# Altium schematic sheet BFMC_PowerDistribution.SchDoc
size A; SheetNumber: 4; SheetTotal: 7
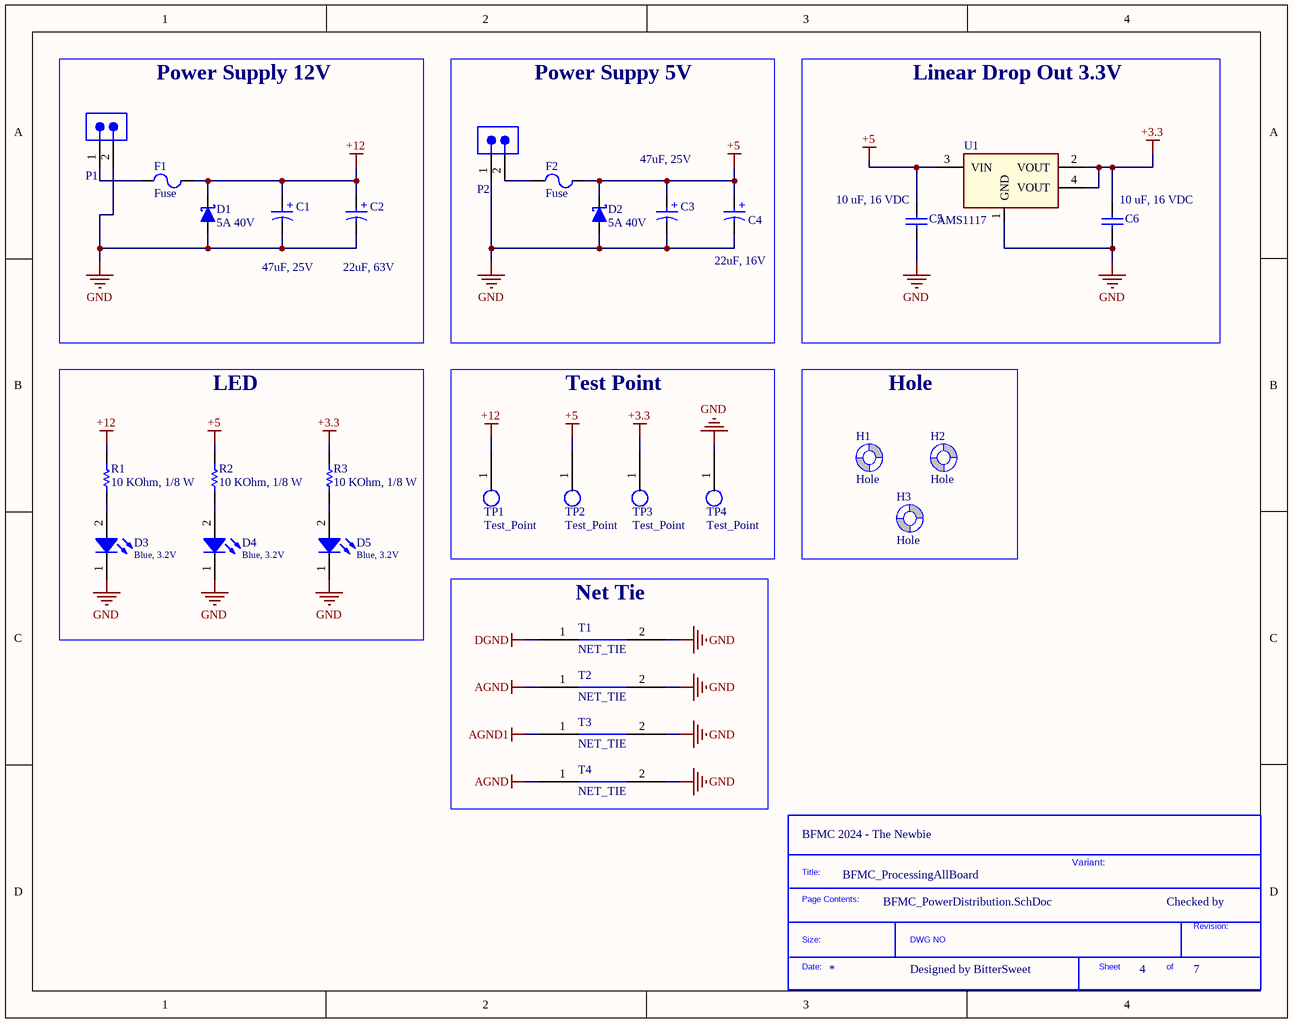
[diagram p0: BFMC_PowerDistribution.SchDoc]

## Parts
*?  SDTitleBlock  (value not drawn)  (graphical)
C1  47uF, 25V  [WCAP-ASLI_D6.3H5.5]
C2  22uF, 63V  [WCAP-ASLI_D6.3H7.7]
C3  47uF, 25V  [WCAP-ASLI_D6.3H5.5]
C4  22uF, 16V  [WCAP-ASLI_D4H5.5]
C5  10 uF, 16 VDC  [CAP_0805]
C6  10 uF, 16 VDC  [CAP_0805]
D1  5A 40V  [DO-214AB, SMA]
D2  5A 40V  [DO-214AB, SMA]
D3  Blue, 3.2V  [WL-SMCW_0805]
D4  Blue, 3.2V  [WL-SMCW_0805]
D5  Blue, 3.2V  [WL-SMCW_0805]
F1  Fuse  [FuseHolder1808]
F2  Fuse  [FuseHolder1808]
H1  Hole  [Hole_3.2mm]
H2  Hole  [Hole_3.2mm]
H3  Hole  [HOLE_RECTANGLE]
P1  10A, 300V  [691322310002]  (value not drawn)
P2  10A, 300V  [691322310002]  (value not drawn)
R1  10 KOhm, 1/8 W  [RESISTOR_0805]
R2  10 KOhm, 1/8 W  [RESISTOR_0805]
R3  10 KOhm, 1/8 W  [RESISTOR_0805]
T1  NET_TIE  [NET_TIE_2.0mm]
T2  NET_TIE  [NET_TIE_0.5MM]
T3  NET_TIE  [NET_TIE_0.5MM]
T4  NET_TIE  [NET_TIE_0.5MM]
TP1  Test_Point  [TP_1_5mm_SMD]
TP2  Test_Point  [TP_1_5mm_SMD]
TP3  Test_Point  [TP_1_5mm_SMD]
TP4  Test_Point  [TP_1_5mm_SMD]
U1  AMS1117  [AMS1117]

## Blocks framed on the sheet
Power Supply 12V: C1 C2 D1 F1 P1
Power Suppy 5V: C3 C4 D2 F2 P2
Linear Drop Out 3.3V: C5 C6 U1
LED: D3-D5 R1-R3
Test Point: TP1-TP4
Hole: H1-H3
Net Tie: T1-T4

## Nets
+3.3: C6.2 R3.1 TP3.1 U1.2(VOUT) U1.4(VOUT)
+5: C3.1(P) C4.1(P) C5.2 D2.2(K) F2.2 R2.1 TP2.1 U1.3(VIN)
+12: C1.1(P) C2.1(P) D1.2(K) F1.2 R1.1 TP1.1
AGND: T2.1 T4.1
AGND1: T3.1
DGND: T1.1
GND: C1.2(N) C2.2(N) C3.2(N) C4.2(N) C5.1 C6.1 D1.1(A) D2.1(A) D3.1(K) D4.1(K) D5.1(K) P1.2 P2.1 T1.2 T2.2 T3.2 T4.2 TP4.1 U1.1(GND)
NetD3_2: D3.2(A) R1.2
NetD4_2: D4.2(A) R2.2
NetD5_2: D5.2(A) R3.2
NetF1_1: F1.1 P1.1
NetF2_1: F2.1 P2.2

Not connected (* = marked no-connect by the designer): H1 1(Screw); H2 1(Screw); H3 1(Screw)

## Notes on the sheet
- (near *?) BFMC 2024 - The Newbie
- BFMC_ProcessingAllBoard
- Variant:
- Checked by
- Designed by BitterSweet
- (in symbol 865080340003) +
- (in symbol 865080443007) +
- (in symbol 865080745011) +
- (in symbol SDTitleBlock) Title:; Page Contents:; Revision:; Size:; DWG NO; Date:; Sheet; of

## Library data of the parts
C1 C3 = 865080443007: V-Chip, D6.3 x H5.5mm, 47uF, 25V; Manufacturer: Wurth Elektronik; Capacitance Tolerance: +/-20%; Dissipation Factor: 14%; Endurance: 2000h; Leakage Current: 11.75uA; Ripple Current: 220mA; Category: Aluminum Electrolytic Capacitors; ComponentLink2Description: Datasheet Link; ComponentLink2URL: https://www.we-online.com/redexpert/spec/865080443007?ad; Mount: Surface Mount; Operating Temperature Max: 105°C; Operating Temperature Min: -55°C; Packaging: Tape and Reel; Height: 5.5mm; Diameter: 6.3mm; Capacitance: 47uF; Rated Voltage (DC): 25V; Supplier 1 Name: Mouser; Supplier 1 SN: 710-865080443007; Supplier 1 URL: https://www.mouser.com/ProductDetail/Wurth-Elektronik/865080443007?qs=0KOYDY2FL29hh2FHnT7VZA%3D%3D; Supplier 3 Name: thegioiic; Supplier 3 URL: https://www.thegioiic.com/tu-nhom-smd-47uf-25v-6-3x5-4mm; Manufacturer Part Number: N/A; Supplier 2 Name: Digi-Key; Supplier 2 SN: N/A; Supplier 2 URL: N/A; Supplier 3 SN: N/A; Value: 47uF, 25V
C2 = 865080745011: V-Chip, D6.3 x H7.7mm, 22uF, 63V; Manufacturer: Wurth Elektronik; Capacitance Tolerance: +/-20%; Dissipation Factor: 12%; Endurance: 2000h; Leakage Current: 13.86uA; Ripple Current: 58mA; Category: Aluminum Electrolytic Capacitors; ComponentLink2Description: Datasheet Link; ComponentLink2URL: https://www.we-online.com/redexpert/spec/865080745011?ad; Mount: Surface Mount; Operating Temperature Max: 105°C; Operating Temperature Min: -55°C; Packaging: Tape and Reel; Height: 7.7mm; Diameter: 6.3mm; Capacitance: 22uF; Rated Voltage (DC): 63V; Supplier 1 Name: Mouser; Supplier 1 SN: 710-865080745011; Supplier 1 URL: https://www.mouser.vn/ProductDetail/Wurth-Elektronik/865080745011?qs=amGC7iS6iy%2FPRPUkpVJ4xg%3D%3D; Supplier 3 Name: thegioiic; Supplier 3 URL: https://www.thegioiic.com/tu-nhom-smd-22uf-63v-6-3x7-7mm; Manufacturer Part Number: N/A; Supplier 2 Name: Digi-Key; Supplier 2 SN: N/A; Supplier 2 URL: N/A; Supplier 3 SN: N/A; Value: 22uF, 63V
C4 = 865080340003: V-Chip, D4 x H5.5mm, 22uF, 16V; Manufacturer: Wurth Elektronik; Capacitance Tolerance: +/-20%; Dissipation Factor: 16%; Endurance: 2000h; Leakage Current: 3.52uA; Ripple Current: 90mA; Category: Aluminum Electrolytic Capacitors; ComponentLink2Description: Datasheet Link; ComponentLink2URL: https://www.we-online.com/redexpert/spec/865080340003?ad; Mount: Surface Mount; Operating Temperature Max: 105°C; Operating Temperature Min: -55°C; Packaging: Tape and Reel; Height: 5.5mm; Diameter: 4mm; Capacitance: 22uF; Rated Voltage (DC): 16V; Supplier 1 Name: Mouser; Supplier 1 SN: 710-865080340003; Supplier 1 URL: https://www.mouser.com/ProductDetail/Wurth-Elektronik/865080340003?qs=0KOYDY2FL2%252BowmC4S50IuQ%3D%3D; Supplier 3 Name: thegioiic; Supplier 3 URL: https://www.thegioiic.com/tu-nhom-smd-22uf-16v-4x5-4mm; Manufacturer Part Number: N/A; Supplier 2 Name: Digi-Key; Supplier 2 SN: N/A; Supplier 2 URL: N/A; Supplier 3 SN: N/A; Value: 22uF, 16V
C5 C6 = 0108051061016: CAP, size 0805, 10 uF, 16 VDC; Manufacture Name: TDK; Manufacture SN: CGA4J1X7S1C106K125AE; Capacitance: 10 uF; Tolerance: +/-10%; Voltage Rating DC: 16 VDC; ComponentLink2Description: Datasheet; ComponentLink2URL: https://product.tdk.com/system/files/dam/doc/product/capacitor/ceramic/mlcc/catalog/mlcc_automotive_soft_en.pdf?ref_disty=mouser; Operating Temperature: -55 to +125degC; Packaging: Tape and Reel; Mounting Technology: SMT; Size: 0805; Supplier 1 Name: Mouser; Supplier 1 SN: 810-CGA4J1X7S1C106KA; Supplier 1 URL: https://www.mouser.vn/ProductDetail/TDK/CGA4J1X7S1C106K125AE?qs=nQSIdc08i%252Bda5YDbrVYncg%3D%3D&utm_source=mouser-refine-download&utm_medium=file&utm_campaign=CGA4J1X7S1C106K125AE&utm_content=TDK; Supplier 2 Name: Digi-Key; Supplier 2 SN: 445-173674-2-ND; Supplier 2 URL: https://www.digikey.com/en/products/detail/tdk-corporation/cga4j1x7s1c106k125ae/5809239; Supplier 3 Name: thegioiic; Supplier 3 SN: OEM; Supplier 3 URL: https://www.thegioiic.com/tu-gom-0805-10uf-16v; Value: 10 uF, 16 VDC
D1 D2 = Diode_Schottky: SS54 SMC Diode Schottky 5A 40V; Supplier 3 URL: https://www.thegioiic.com/twgmc-ss34-sma-diode-schottky-3a
D3-D5 = 160805BlueBlur: WL-SMCW SMT Mono-color Chip LED Blur, size 0805, Blue, 3.2V, 140deg; Color: Blue; Size: 0603; Type: Blur; ComponentLink1Description: Datasheet link; ComponentLink1URL: N/A; ComponentLink2Description: Supplier 1 URL; ComponentLink2URL: https://www.mouser.vn/ProductDetail/Broadcom-Avago/HSMR-C170?qs=YDL0qNrpDT75U8LW5zK4Qg%3D%3D; ComponentLink3Description: Supplier 2 URL; ComponentLink3URL: https://www.digikey.com/en/products/detail/broadcom-limited/HSMR-C170/637706; ComponentLink4Description: Supplier 3 URL; ComponentLink4URL: N/A; Supplier 1 Name: Mouser; Supplier 1 SN: 630-HSMR-C170; Supplier 1 URL: https://www.mouser.vn/ProductDetail/Broadcom-Avago/HSMR-C170?qs=YDL0qNrpDT75U8LW5zK4Qg%3D%3D; Supplier 2 Name: Digi-Key; Supplier 2 SN: 516-1445-2-ND; Supplier 2 URL: https://www.digikey.com/en/products/detail/broadcom-limited/HSMR-C170/637706; Supplier 3 Name: ICDayRoi; Supplier 3 SN: N/A; Supplier 3 URL: https://www.thegioiic.com/led-xanh-la-0805-dan-smd-trong-suot-harvatek; Value: Blue, 3.2V
P1 P2 = 691322310002: WR-TBL Series 322 Horizontal PCB Header, THT, pitch 3.81mm, 2p; Manufacturer: Wurth Elektronik; Modularity: No; ComponentLink1Description: Datasheet Link; ComponentLink1URL: https://www.we-online.com/redexpert/spec/691322310002?ad; ComponentLink2Description: Supplier 1 URL; ComponentLink2URL: N/A; Manufacturer Part Number: 691322310002; Category: Terminal Blocks; Match Code: WR-TBL; Mount: Through Hole; Operating Temperature Max: 105°C; Operating Temperature Min: -40°C; Packaging: Box; Application: Pluggable; Number of Pins: 2; Number of Rows: 1; Orientation: Horizontal; Pitch: 3.81mm; Rated Current: 10A; Working Voltage: 300V; ComponentLink3Description: Supplier 2 URL; ComponentLink3URL: N/A; ComponentLink4Description: Supplier 3 URL; ComponentLink4URL: https://www.thegioiic.com/kf-3-81-2-r-terminal-block-plug-in-han-pcb-2-chan-cong-3-81mm-300v-10a; Supplier 1 Name: Mouser; Supplier 1 SN: N/A; Supplier 1 URL: N/A; Supplier 2 Name: Digi-Key; Supplier 2 SN: N/A; Supplier 2 URL: N/A; Supplier 3 Name: thegioiic; Supplier 3 SN: N/A; Supplier 3 URL: https://www.thegioiic.com/kf-3-81-2-r-terminal-block-plug-in-han-pcb-2-chan-cong-3-81mm-300v-10a; Value: 10A, 300V
R1-R3 = 0008051035: RES, size 0805, 10 KOhm, 1/8 W; Manufacture  Name: Vishay Dale; Manufacture  SN: CRCW080510K0JNEAC; Resistance tolerance: +/-5%; Rated Power: 1/8 W; Resistance: 10 KOhm; Size: 0805; Mounting Technology: SMT; Supplier 1 Name: Mouser; Supplier 1 SN: 71-CRCW080510K0JNEB; Supplier 1 URL: https://www.mouser.vn/ProductDetail/Vishay-Dale/CRCW080510K0JNEB?qs=LOX6nxTstiZ5fn9YUdHx5A%3D%3D; Supplier 2 Name: Digi-Key; Supplier 2 SN: 541-4163-2-ND; Supplier 2 URL: https://www.digikey.com/en/products/detail/vishay-dale/CRCW080510K0JNEAC/7928585; Supplier 3 Name: Thegioiic; Supplier 3 SN: N/A; Supplier 3 URL: https://www.thegioiic.com/dien-tro-10-kohm-0805-1-; Value: 10 KOhm, 1/8 W; ComponentLink1Description: Datasheet link; ComponentLink1URL: https://www.vishay.com/docs/28773/crcwce3.pdf; ComponentLink2Description: Supplier 1 URL; ComponentLink2URL: https://www.mouser.vn/ProductDetail/Vishay-Dale/CRCW080510K0JNEB?qs=LOX6nxTstiZ5fn9YUdHx5A%3D%3D; ComponentLink3Description: Supplier 2 URL; ComponentLink3URL: https://www.digikey.com/en/products/detail/vishay-dale/CRCW080510K0JNEAC/7928585; ComponentLink4Description: Supplier 3 URL; ComponentLink4URL: N/A
T1-T4 = NET_TIE: Straight Net Tie
U1 = AMS1117: IC Linear Drop Out 3.3V 1A SOT-223; Supplier 3 URL: https://www.thegioiic.com/ams1117-3-3v-ic-on-ap-3-3v-1a-sot-223
F1 F2 = Fuse: JLCPCB Part: *; URL: *; Supplier 3 URL: https://www.thegioiic.com/de-cau-chi-1808-dan-smd